# Altium project SM3280_USBA.PrjPcb
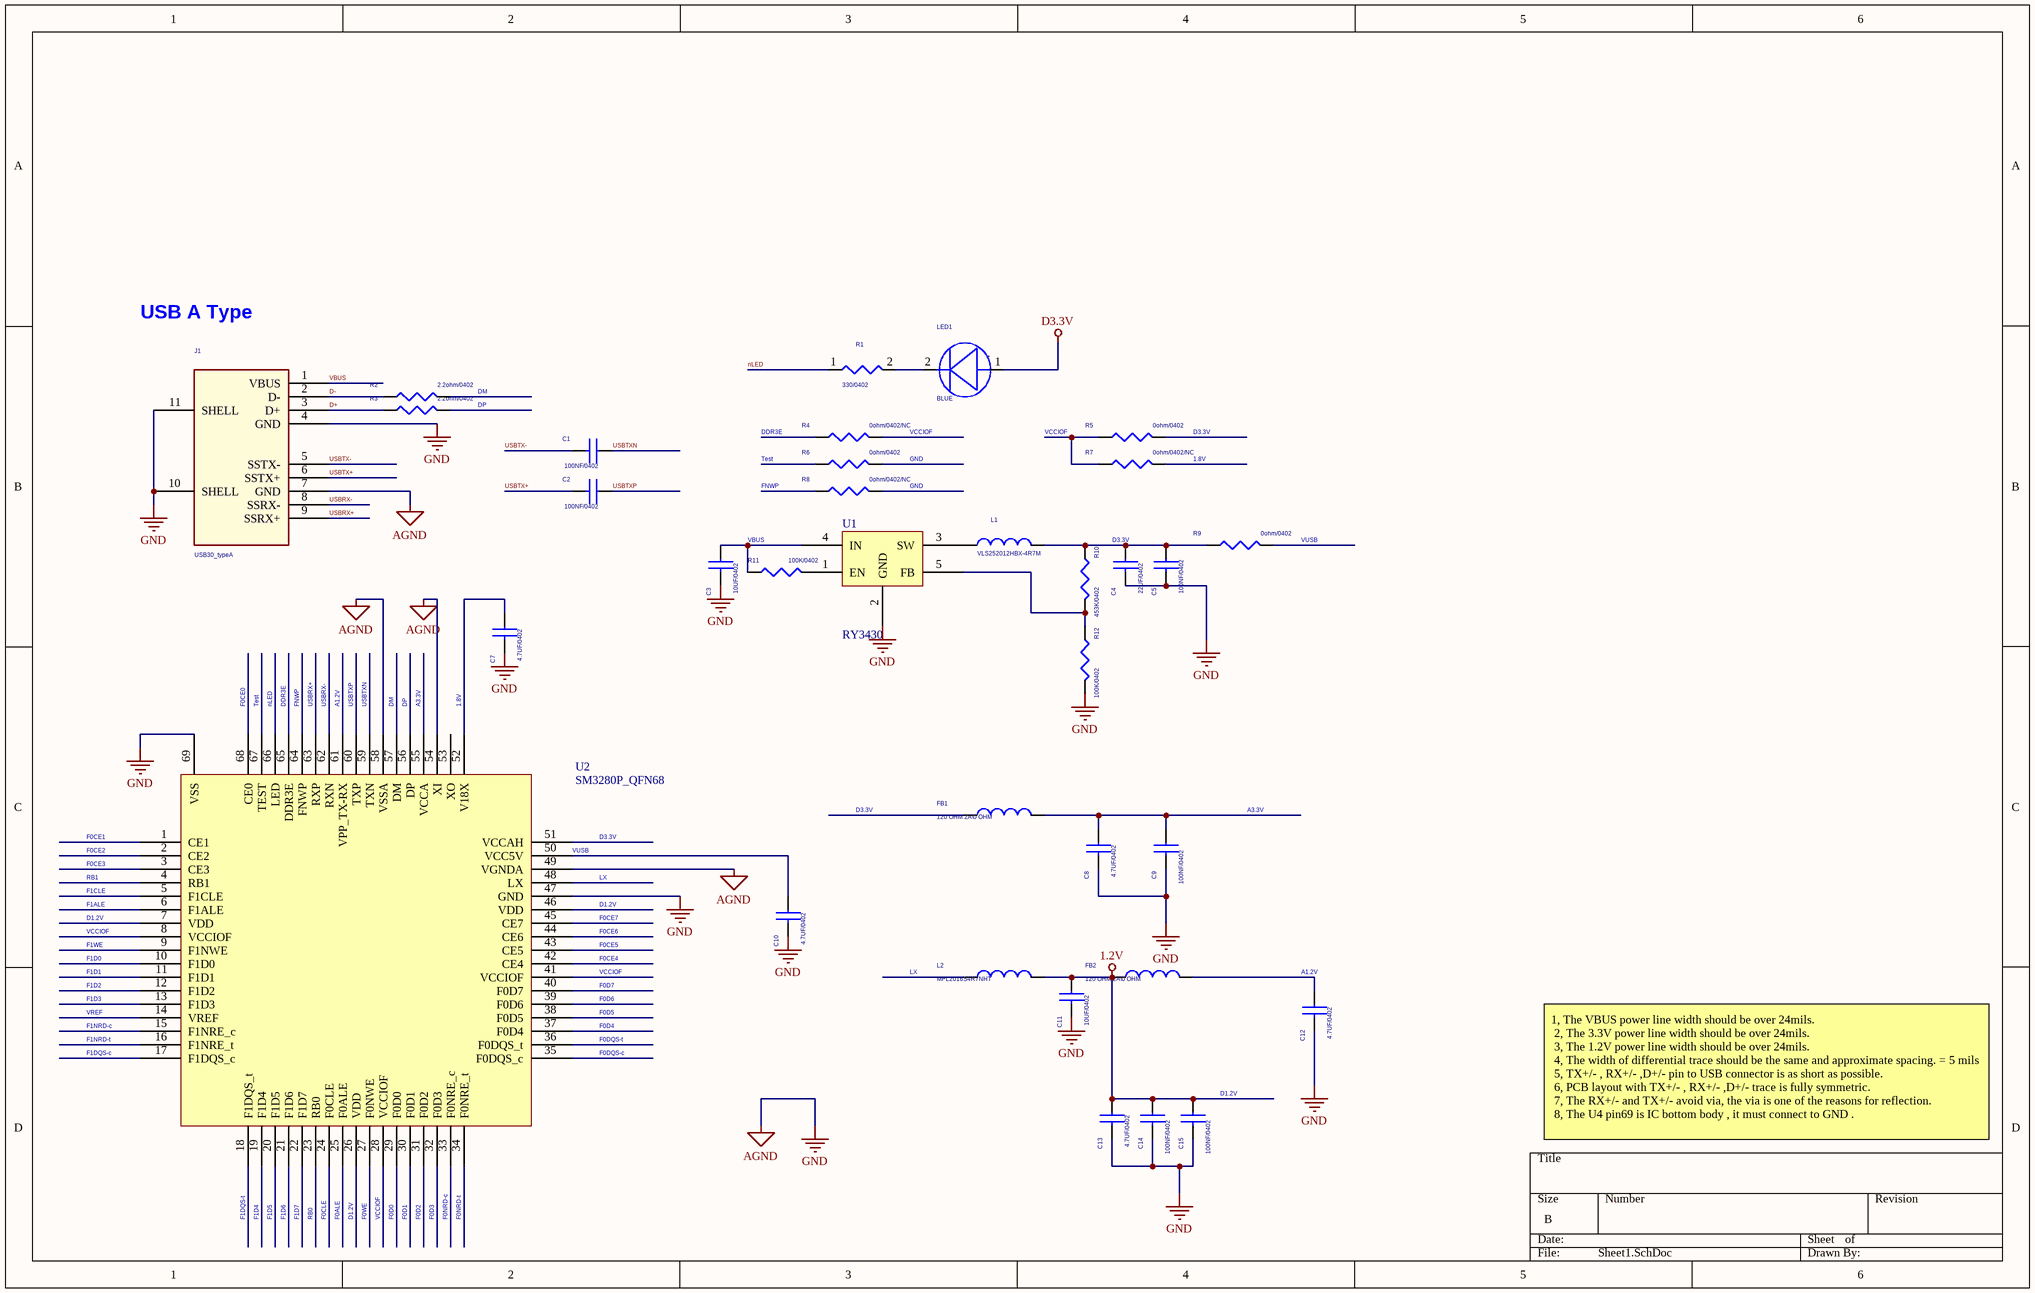
[diagram p0: Sheet1.SchDoc]
2 sheets, 45 parts. Net scope: global (net labels, ports and power ports of the same name join across sheets).
Sheets:
  Sheet1.SchDoc
  Sheet2.SchDoc

## Sheet Sheet1.SchDoc
size B

### Parts
C1  100NF/0402  [C0402]
C2  100NF/0402  [C0402]
C3  10UF/0402  [C0402]
C4  22UF/0402  [C0402]
C5  100NF/0402  [C0402]
C7  4.7UF/0402  [C0402]
C8  4.7UF/0402  [C0402]
C9  100NF/0402  [C0402]
C10  4.7UF/0402  [C0402]
C11  10UF/0402  [C0402]
C12  4.7UF/0402  [C0402]
C13  4.7UF/0402  [C0402]
C14  100NF/0402  [C0201]
C15  100NF/0402  [C0402]
FB1  120 OHM 2A\0 OHM  [SL0402]
FB2  120 OHM 2A\0 OHM  [SL0402]
J1  USB30_typeA  [USB-3.0AAAA]
L1  VLS252012HBX-4R7M  [L2520]
L2  MPL2016S4R7NHT  [L2016]
LED1  BLUE  [LED0603]
R1  330/0402  [R0402]
R2  2.2ohm/0402  [R0402]
R3  2.2ohm/0402  [R0402]
R4  0ohm/0402/NC  [R0201]
R5  0ohm/0402  [R0201]
R6  0ohm/0402  [R0201]
R7  0ohm/0402/NC  [R0201]
R8  0ohm/0402/NC  [R0201]
R9  0ohm/0402  [R0201]
R10  453K/0402  [R0402]
R11  100K/0402  [R0402]
R12  100K/0402  [R0402]
U1  RY3430
U2  SM3280P_QFN68

### Nets
D1.2V: C11.1 C13.1 C14.1 C15.1 FB2.1 L2.2 U2.7(VDD) U2.26(VDD) U2.46(VDD)  [also labelled 1.2V]
D3.3V: C4.1 C5.1 FB1.1 L1.2 LED1.1(ANODE) R5.2 R9.1 R10.1 U2.51(VCCAH)
GND: C3.2 C4.2 C5.2 C7.2 C8.2 C9.2 C10.2 C11.2 C12.2 C13.2 C14.2 C15.2 J1.4(GND) J1.7(GND) J1.10(SHELL) J1.11(SHELL) R6.2 R8.2 R12.2 U1.2(GND) U2.47(GND) U2.49(VGNDA) U2.54(XI) U2.58(VSSA) U2.69(VSS)  [also labelled AGND]
VCCIOF: R4.2 R5.1 R7.1 U2.8(VCCIOF) U2.28(VCCIOF) U2.41(VCCIOF)
VREF: U2.14(VREF)
1.8V: C7.1 R7.2 U2.52(V18X)
A1.2V: C12.1 FB2.2 U2.61(VPP_TX-RX)
A3.3V: C8.1 C9.1 FB1.2 U2.55(VCCA)
D+: J1.3(D+) R3.1
D-: J1.2(D-) R2.1
DDR3E: R4.1 U2.65(DDR3E)
DM: R2.2 U2.57(DM)
DP: R3.2 U2.56(DP)
F0ALE: U2.25(F0ALE)
F0CE0: U2.68(CE0)
F0CE1: U2.1(CE1)
F0CE2: U2.2(CE2)
F0CE3: U2.3(CE3)
F0CE4: U2.42(CE4)
F0CE5: U2.43(CE5)
F0CE6: U2.44(CE6)
F0CE7: U2.45(CE7)
F0CLE: U2.24(F0CLE)
F0D0: U2.29(F0D0)
F0D1: U2.30(F0D1)
F0D2: U2.31(F0D2)
F0D3: U2.32(F0D3)
F0D4: U2.37(F0D4)
F0D5: U2.38(F0D5)
F0D6: U2.39(F0D6)
F0D7: U2.40(F0D7)
F0DQS-c: U2.35(F0DQS_c)
F0DQS-t: U2.36(F0DQS_t)
F0NRD-c: U2.33(F0NRE_c)
F0NRD-t: U2.34(F0NRE_t)
F0WE: U2.27(F0NWE)
F1ALE: U2.6(F1ALE)
F1CLE: U2.5(F1CLE)
F1D0: U2.10(F1D0)
F1D1: U2.11(F1D1)
F1D2: U2.12(F1D2)
F1D3: U2.13(F1D3)
F1D4: U2.19(F1D4)
F1D5: U2.20(F1D5)
F1D6: U2.21(F1D6)
F1D7: U2.22(F1D7)
F1DQS-c: U2.17(F1DQS_c)
F1DQS-t: U2.18(F1DQS_t)
F1NRD-c: U2.15(F1NRE_c)
F1NRD-t: U2.16(F1NRE_t)
F1WE: U2.9(F1NWE)
FNWP: R8.1 U2.64(FNWP)
LX: L2.1 U2.48(LX)
nLED: R1.1 U2.66(LED)
RB0: U2.23(RB0)
RB1: U2.4(RB1)
Test: R6.1 U2.67(TEST)
USBRX+: J1.9(SSRX+) U2.63(RXP)
USBRX-: J1.8(SSRX-) U2.62(RXN)
USBTX+: C2.2 J1.6(SSTX+)
USBTX-: C1.2 J1.5(SSTX-)
USBTXN: C1.1 U2.59(TXN)
USBTXP: C2.1 U2.60(TXP)
VBUS: C3.1 J1.1(VBUS) R11.1 U1.4(IN)
VUSB: C10.1 R9.2 U2.50(VCC5V)
NetL1_1: L1.1 U1.3(SW)
NetLED1_2: LED1.2(CATHODE) R1.2
NetR10_2: R10.2 R12.1 U1.5(FB)

Not connected (* = marked no-connect by the designer): R11 2; U1 1(EN); U2 53(XO)

### Notes on the sheet
- USB A Type
- 1, The VBUS power line width should be over 24mils.
  2, The 3.3V power line width should be over 24mils.
  3, The 1.2V power line width should be over 24mils.
  4, The width of differential trace should be the same and approximate spacing. = 5 mils
  5, TX+/- , RX+/- ,D+/- pin to USB connector is as short as possible.
  6, PCB layout with TX+/- , RX+/- ,D+/- trace is fully symmetric.
  7, The RX+/- and TX+/- avoid via, the via is one of the reasons for reflection.
  8, The U4 pin69 is IC bottom body , it must connect to GND .
- (in symbol LED) +

### Library data of the parts
C1-C5 C7 C8 C10-C13 = C0603: CRITICAL_PART: N; MANUFACTURER: PANASONIC; MANUFACTURER_PN: ECJ1VB0J106M; PART_NUMBER: 11G10210621R; PART_TYPE: 11_C; TABLES: 11; CLASS: Passive; COMPONENT_NAME: MLCC SMD 10UF 6.3V 0603 X5R 20%; ELECTRIC_SPEC: 6.3V 0603 X5R 20%; OPTIONAL: I; TOLERANCE: 20%; CREATED_DATE: 2009/10/6; DATABASE_UPDATE: 2009/10/6; DATASHEET: N/A; PACKAGE_TYPE: SMD; QVL_APPROVE: N
C9 C14 C15 = C0402_Dup1: PART_TYPE: 11_C; PART_NUMBER: 11G101104340; MANUFACTURER_PN: 0402F104Z250CT; MANUFACTURER: WALSIN; TOLERANCE: +80/-20%; QVL_APPROVE: N; OPTIONAL: I; ELECTRIC_SPEC: 25V 0402 Y5V +80/-20%; COMPONENT_NAME: MLCC SMD 100NF 25V 0402 Y5V +80/-20%; CLASS: Passive; TABLES: 11; PACKAGE_TYPE: SMD; DATASHEET: T:\division\SD\JM_CIS_Database\05_Datasheet\11_Capacitor\Walsin_MLCC_All.pdf; DATABASE_UPDATE: 2009/10/6; CRITICAL_PART: N; CREATED_DATE: 2009/10/6
FB1 FB2 = FB0603: FB SMD 120 OHM 2A 0402; Part_Type: 09_Inductor; Part Number: 09G102000160; Manufacturer_PN: BLM18PG121SN1D; Manufacturer: MURATA; QVL_Approve: N; Optional: I; Electric_Spec: 120 OHM 2A 0603; Component_Name: FB SMD 120 OHM 2A 0603; Class: Discrete; Tolerance: N/A; Package Type: SMD; Datasheet: T:\division\SD\JM_CIS_Database\05_Datasheet\09_Inductor\09G102000160.pdf; Critical_Part: N
J1 = USB30 connector_0
L1 = GNR2512PA-1R0M_0: CRITICAL_PART: N; MANUFACTURER: GOTREND; PART_NUMBER: 09G1502034A0; PART_TYPE: 09_Inductor; TABLES: 09; COMPONENT_NAME: CHOKE SMD 1.0UH/3.45A(MAX) +/-20% GNR2512PA-1R0M; ELECTRIC_SPEC: 1.0UH/3.45A(MAX); OPTIONAL: I; TOLERANCE: +/-20%; CREATED_DATE: 2015/11/6; DATABASE_UPDATE: 2015/11/6; DATASHEET: T:\division\Division_Share\JM_CIS_Database\05_Datasheet\09_Inductor\09G1502034A0.pdf; MANUFACTURER_PN: GNR2512PA-1R0M; PACKAGE_TYPE: SMD; QVL_APPROVE: N
L2 = FB0603: Part_Type: 09_Inductor; Part Number: 09G102000160; Manufacturer_PN: BLM18PG121SN1D; Manufacturer: MURATA; QVL_Approve: N; Optional: I; Electric_Spec: 120 OHM 2A 0603; Component_Name: FB SMD 120 OHM 2A 0603; Class: Discrete; Tolerance: N/A; Package Type: SMD; Datasheet: T:\division\SD\JM_CIS_Database\05_Datasheet\09_Inductor\09G102000160.pdf; Critical_Part: N
LED1 = LED: Part Number: 07G015200206; Manufacture: LITEON; Critical_Part: N; Component_Name: LED BLUE (0603) SMD; Electric_SPE: If=5mA/3V; Sourcer: 綠▅篴(X15454); Data_Sheet: K:\DataSheet\07-DISCRETE\07G015200206.pdf; Device: led_2p_63x31_h16; Class: DISCRETE; metal_fabrication: 00000011; Package_Type: SMD; Part Type: 07DISCRETE\LED; Database_Update: 2007/3/3; Modify_Data: 2005/8/10; Optional: N/A; Subsystem_ID: N/A; Colay_Group: N/A; Colay_Alternate: N/A
R1 = R_Dup1: Critical_Part: N; Manufacture: TA-I; Part Number: 10G212102004010; metal_fabrication: 0000001U; Class: DISCRETE; Data_Sheet: J:\DataSheet\10-RESISTOR\10G212102004010.zip; Tolerance: 5%; Electric_SPE: 1/16W; Component_Name: RES 1K OHM 1/16W(0402) 5%; Colay_Alternate: N/A; Colay_Group: N/A; Subsystem_ID: N/A; Optional: N/A; Modify_Data: 2005/2/25; Database_Update: 2009/9/12; Part Type: 10RESISTOR\RESISTOR; Device: r0402; Package_Type: SMD; Symbol_Preview: http://tp-caevm-01/ET_Test/FpPre.aspx?PN=10G212102004010&LIB=COM; Status: All某纔舦5
R2-R9 = R
R10-R12 = R0402: CRITICAL_PART: N; MANUFACTURER: WALSIN; MANUFACTURER_PN: WR04X104JTL; PART_NUMBER: 10G101010410; PART_TYPE: 10_R; TABLES: 10; CLASS: Passive; COMPONENT_NAME: RES SMD 100K OHM 1/16W 0402 5%; ELECTRIC_SPEC: 1/16W 0402 5%; OPTIONAL: I; TOLERANCE: 5%; CREATED_DATE: 2009/10/6; DATABASE_UPDATE: 2009/10/6; DATASHEET: T:\division\SD\JM_CIS_Database\05_Datasheet\10_Resistor\WALSIN_R_All_2009.pdf; PACKAGE_TYPE: SMD; QVL_APPROVE: N

## Sheet Sheet2.SchDoc
size C
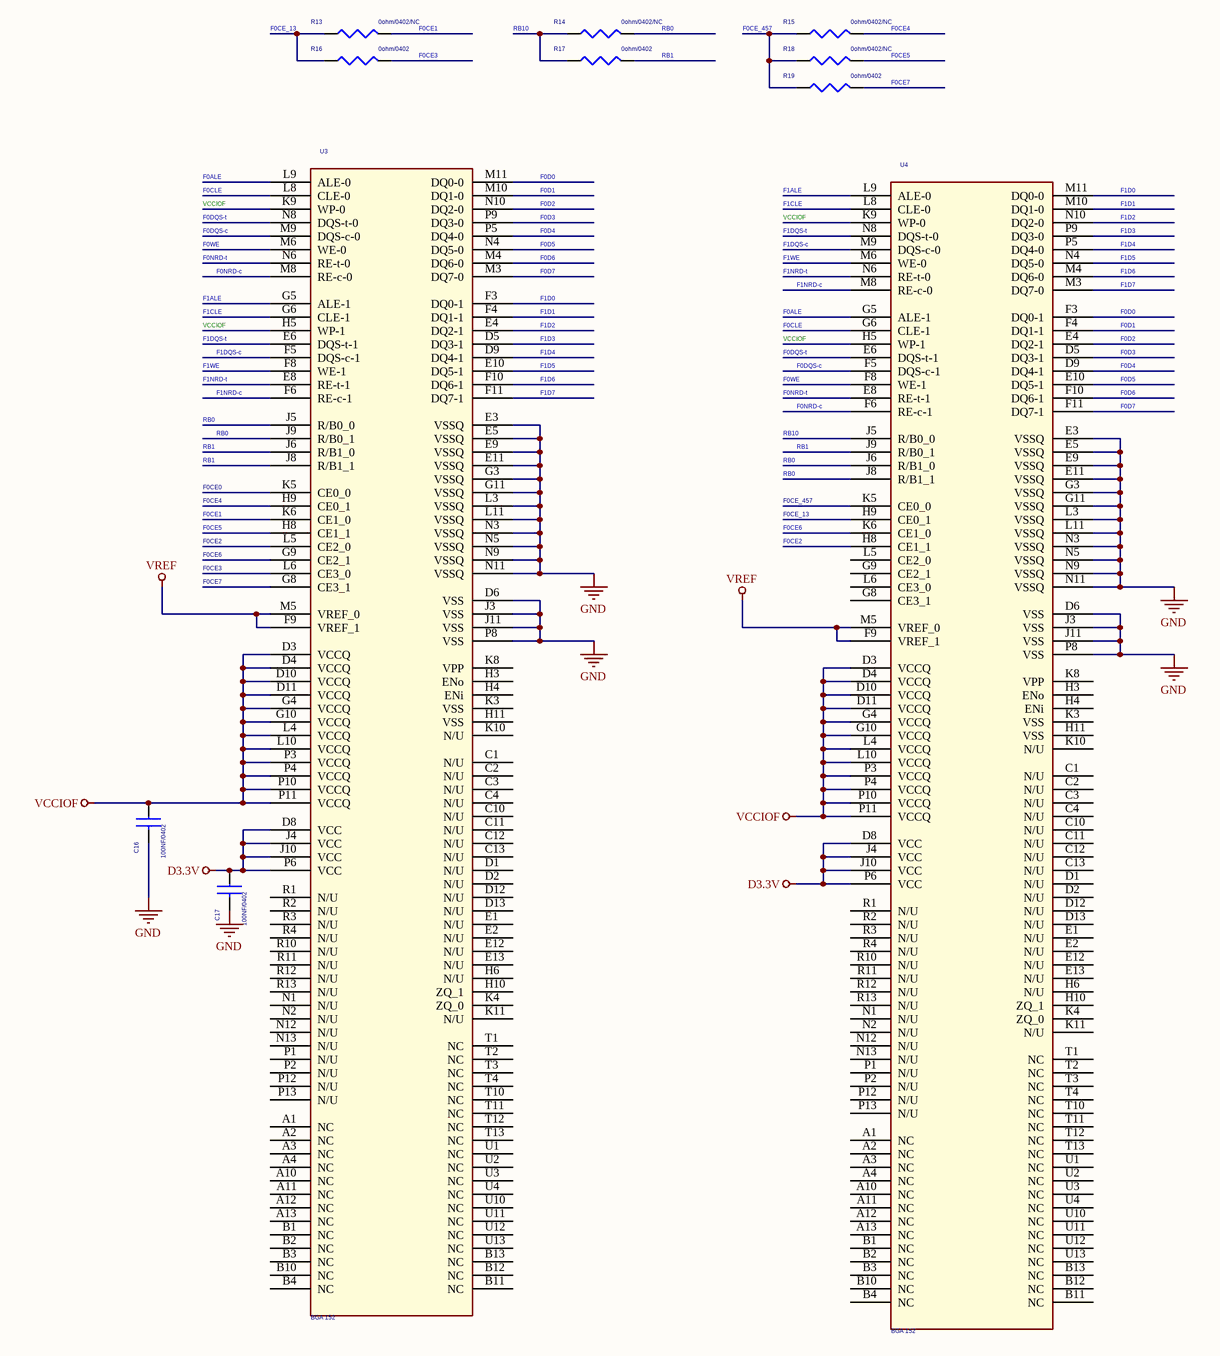
[diagram p1: Sheet2.SchDoc]

### Parts
C16  100NF/0402  [C0402]
C17  100NF/0402  [C0402]
R13  0ohm/0402/NC  [R0201]
R14  0ohm/0402/NC  [R0201]
R15  0ohm/0402/NC  [R0201]
R16  0ohm/0402  [R0201]
R17  0ohm/0402  [R0201]
R18  0ohm/0402/NC  [R0201]
R19  0ohm/0402  [R0201]
U3  BGA 152  [bga152_1_0_14x18]
U4  BGA 152  [bga152_1_0_14x18]

### Nets
D3.3V: C17.1 U3.D8(VCC) U3.J4(VCC) U3.J10(VCC) U3.P6(VCC) U4.D8(VCC) U4.J4(VCC) U4.J10(VCC) U4.P6(VCC)
GND: C16.2 C17.2 U3.D6(VSS) U3.E3(VSSQ) U3.E5(VSSQ) U3.E9(VSSQ) U3.E11(VSSQ) U3.G3(VSSQ) U3.G11(VSSQ) U3.J3(VSS) U3.J11(VSS) U3.L3(VSSQ) U3.L11(VSSQ) U3.N3(VSSQ) U3.N5(VSSQ) U3.N9(VSSQ) U3.N11(VSSQ) U3.P8(VSS) U4.D6(VSS) U4.E3(VSSQ) U4.E5(VSSQ) U4.E9(VSSQ) U4.E11(VSSQ) U4.G3(VSSQ) U4.G11(VSSQ) U4.J3(VSS) U4.J11(VSS) U4.L3(VSSQ) U4.L11(VSSQ) U4.N3(VSSQ) U4.N5(VSSQ) U4.N9(VSSQ) U4.N11(VSSQ) U4.P8(VSS)
VCCIOF: C16.1 U3.D3(VCCQ) U3.D4(VCCQ) U3.D10(VCCQ) U3.D11(VCCQ) U3.G4(VCCQ) U3.G10(VCCQ) U3.H5(WP-1) U3.K9(WP-0) U3.L4(VCCQ) U3.L10(VCCQ) U3.P3(VCCQ) U3.P4(VCCQ) U3.P10(VCCQ) U3.P11(VCCQ) U4.D3(VCCQ) U4.D4(VCCQ) U4.D10(VCCQ) U4.D11(VCCQ) U4.G4(VCCQ) U4.G10(VCCQ) U4.H5(WP-1) U4.K9(WP-0) U4.L4(VCCQ) U4.L10(VCCQ) U4.P3(VCCQ) U4.P4(VCCQ) U4.P10(VCCQ) U4.P11(VCCQ)
VREF: U3.F9(VREF_1) U3.M5(VREF_0) U4.F9(VREF_1) U4.M5(VREF_0)
F0ALE: U3.L9(ALE-0) U4.G5(ALE-1)
F0CE0: U3.K5(CE0_0)
F0CE1: R13.2 U3.K6(CE1_0)
F0CE2: U3.L5(CE2_0) U4.H8(CE1_1)
F0CE3: R16.2 U3.L6(CE3_0)
F0CE4: R15.2 U3.H9(CE0_1)
F0CE5: R18.2 U3.H8(CE1_1)
F0CE6: U3.G9(CE2_1) U4.K6(CE1_0)
F0CE7: R19.2 U3.G8(CE3_1)
F0CE_13: R13.1 R16.1 U4.H9(CE0_1)
F0CE_457: R15.1 R18.1 R19.1 U4.K5(CE0_0)
F0CLE: U3.L8(CLE-0) U4.G6(CLE-1)
F0D0: U3.M11(DQ0-0) U4.F3(DQ0-1)
F0D1: U3.M10(DQ1-0) U4.F4(DQ1-1)
F0D2: U3.N10(DQ2-0) U4.E4(DQ2-1)
F0D3: U3.P9(DQ3-0) U4.D5(DQ3-1)
F0D4: U3.P5(DQ4-0) U4.D9(DQ4-1)
F0D5: U3.N4(DQ5-0) U4.E10(DQ5-1)
F0D6: U3.M4(DQ6-0) U4.F10(DQ6-1)
F0D7: U3.M3(DQ7-0) U4.F11(DQ7-1)
F0DQS-c: U3.M9(DQS-c-0) U4.F5(DQS-c-1)
F0DQS-t: U3.N8(DQS-t-0) U4.E6(DQS-t-1)
F0NRD-c: U3.M8(RE-c-0) U4.F6(RE-c-1)
F0NRD-t: U3.N6(RE-t-0) U4.E8(RE-t-1)
F0WE: U3.M6(WE-0) U4.F8(WE-1)
F1ALE: U3.G5(ALE-1) U4.L9(ALE-0)
F1CLE: U3.G6(CLE-1) U4.L8(CLE-0)
F1D0: U3.F3(DQ0-1) U4.M11(DQ0-0)
F1D1: U3.F4(DQ1-1) U4.M10(DQ1-0)
F1D2: U3.E4(DQ2-1) U4.N10(DQ2-0)
F1D3: U3.D5(DQ3-1) U4.P9(DQ3-0)
F1D4: U3.D9(DQ4-1) U4.P5(DQ4-0)
F1D5: U3.E10(DQ5-1) U4.N4(DQ5-0)
F1D6: U3.F10(DQ6-1) U4.M4(DQ6-0)
F1D7: U3.F11(DQ7-1) U4.M3(DQ7-0)
F1DQS-c: U3.F5(DQS-c-1) U4.M9(DQS-c-0)
F1DQS-t: U3.E6(DQS-t-1) U4.N8(DQS-t-0)
F1NRD-c: U3.F6(RE-c-1) U4.M8(RE-c-0)
F1NRD-t: U3.E8(RE-t-1) U4.N6(RE-t-0)
F1WE: U3.F8(WE-1) U4.M6(WE-0)
RB0: R14.2 U3.J5(R/B0_0) U3.J9(R/B0_1) U4.J6(R/B1_0) U4.J8(R/B1_1)
RB1: R17.2 U3.J6(R/B1_0) U3.J8(R/B1_1) U4.J9(R/B0_1)
RB10: R14.1 R17.1 U4.J5(R/B0_0)

Not connected (* = marked no-connect by the designer): U3 A1(NC) A2(NC) A3(NC) A4(NC) A10(NC) A11(NC) A12(NC) A13(NC) B1(NC) B2(NC) B3(NC) B4(NC) B10(NC) B11(NC) B12(NC) B13(NC) C1(N/U) C2(N/U) C3(N/U) C4(N/U) C10(N/U) C11(N/U) C12(N/U) C13(N/U) D1(N/U) D2(N/U) D12(N/U) D13(N/U) E1(N/U) E2(N/U) E12(N/U) E13(N/U) H3(ENo) H4(ENi) H6(N/U) H10(ZQ_1) H11(VSS) K3(VSS) K4(ZQ_0) K8(VPP) K10(N/U) K11(N/U) N1(N/U) N2(N/U) N12(N/U) N13(N/U) P1(N/U) P2(N/U) P12(N/U) P13(N/U) R1(N/U) R2(N/U) R3(N/U) R4(N/U) R10(N/U) R11(N/U) R12(N/U) R13(N/U) T1(NC) T2(NC) T3(NC) T4(NC) T10(NC) T11(NC) T12(NC) T13(NC) U1(NC) U2(NC) U3(NC) U4(NC) U10(NC) U11(NC) U12(NC) U13(NC); U4 A1(NC) A2(NC) A3(NC) A4(NC) A10(NC) A11(NC) A12(NC) A13(NC) B1(NC) B2(NC) B3(NC) B4(NC) B10(NC) B11(NC) B12(NC) B13(NC) C1(N/U) C2(N/U) C3(N/U) C4(N/U) C10(N/U) C11(N/U) C12(N/U) C13(N/U) D1(N/U) D2(N/U) D12(N/U) D13(N/U) E1(N/U) E2(N/U) E12(N/U) E13(N/U) G8(CE3_1) G9(CE2_1) H3(ENo) H4(ENi) H6(N/U) H10(ZQ_1) H11(VSS) K3(VSS) K4(ZQ_0) K8(VPP) K10(N/U) K11(N/U) L5(CE2_0) L6(CE3_0) N1(N/U) N2(N/U) N12(N/U) N13(N/U) P1(N/U) P2(N/U) P12(N/U) P13(N/U) R1(N/U) R2(N/U) R3(N/U) R4(N/U) R10(N/U) R11(N/U) R12(N/U) R13(N/U) T1(NC) T2(NC) T3(NC) T4(NC) T10(NC) T11(NC) T12(NC) T13(NC) U1(NC) U2(NC) U3(NC) U4(NC) U10(NC) U11(NC) U12(NC) U13(NC)

### Library data of the parts
C16 C17 = C0402_Dup1: as C9 on sheet Sheet1; PACKAGE_TYPE: SMD; DATASHEET: T:\division\SD\JM_CIS_Database\05_Datasheet\11_Capacitor\Walsin_MLCC_All.pdf; DATABASE_UPDATE: 2009/10/6; CRITICAL_PART: N; CREATED_DATE: 2009/10/6
R13-R19 = R
U3 U4 = TMP_0

## Nets that join several sheets
D3.3V: Sheet1 (9 pins), Sheet2 (9 pins)
GND: Sheet1 (25 pins), Sheet2 (34 pins)
VCCIOF: Sheet1 (6 pins), Sheet2 (29 pins)
VREF: Sheet1 (U2.14), Sheet2 (U3.F9 U3.M5 U4.F9 U4.M5)
F0ALE: Sheet1 (U2.25), Sheet2 (U3.L9 U4.G5)
F0CE0: Sheet1 (U2.68), Sheet2 (U3.K5)
F0CE1: Sheet1 (U2.1), Sheet2 (R13.2 U3.K6)
F0CE2: Sheet1 (U2.2), Sheet2 (U3.L5 U4.H8)
F0CE3: Sheet1 (U2.3), Sheet2 (R16.2 U3.L6)
F0CE4: Sheet1 (U2.42), Sheet2 (R15.2 U3.H9)
F0CE5: Sheet1 (U2.43), Sheet2 (R18.2 U3.H8)
F0CE6: Sheet1 (U2.44), Sheet2 (U3.G9 U4.K6)
F0CE7: Sheet1 (U2.45), Sheet2 (R19.2 U3.G8)
F0CLE: Sheet1 (U2.24), Sheet2 (U3.L8 U4.G6)
F0D0: Sheet1 (U2.29), Sheet2 (U3.M11 U4.F3)
F0D1: Sheet1 (U2.30), Sheet2 (U3.M10 U4.F4)
F0D2: Sheet1 (U2.31), Sheet2 (U3.N10 U4.E4)
F0D3: Sheet1 (U2.32), Sheet2 (U3.P9 U4.D5)
F0D4: Sheet1 (U2.37), Sheet2 (U3.P5 U4.D9)
F0D5: Sheet1 (U2.38), Sheet2 (U3.N4 U4.E10)
F0D6: Sheet1 (U2.39), Sheet2 (U3.M4 U4.F10)
F0D7: Sheet1 (U2.40), Sheet2 (U3.M3 U4.F11)
F0DQS-c: Sheet1 (U2.35), Sheet2 (U3.M9 U4.F5)
F0DQS-t: Sheet1 (U2.36), Sheet2 (U3.N8 U4.E6)
F0NRD-c: Sheet1 (U2.33), Sheet2 (U3.M8 U4.F6)
F0NRD-t: Sheet1 (U2.34), Sheet2 (U3.N6 U4.E8)
F0WE: Sheet1 (U2.27), Sheet2 (U3.M6 U4.F8)
F1ALE: Sheet1 (U2.6), Sheet2 (U3.G5 U4.L9)
F1CLE: Sheet1 (U2.5), Sheet2 (U3.G6 U4.L8)
F1D0: Sheet1 (U2.10), Sheet2 (U3.F3 U4.M11)
F1D1: Sheet1 (U2.11), Sheet2 (U3.F4 U4.M10)
F1D2: Sheet1 (U2.12), Sheet2 (U3.E4 U4.N10)
F1D3: Sheet1 (U2.13), Sheet2 (U3.D5 U4.P9)
F1D4: Sheet1 (U2.19), Sheet2 (U3.D9 U4.P5)
F1D5: Sheet1 (U2.20), Sheet2 (U3.E10 U4.N4)
F1D6: Sheet1 (U2.21), Sheet2 (U3.F10 U4.M4)
F1D7: Sheet1 (U2.22), Sheet2 (U3.F11 U4.M3)
F1DQS-c: Sheet1 (U2.17), Sheet2 (U3.F5 U4.M9)
F1DQS-t: Sheet1 (U2.18), Sheet2 (U3.E6 U4.N8)
F1NRD-c: Sheet1 (U2.15), Sheet2 (U3.F6 U4.M8)
F1NRD-t: Sheet1 (U2.16), Sheet2 (U3.E8 U4.N6)
F1WE: Sheet1 (U2.9), Sheet2 (U3.F8 U4.M6)
RB0: Sheet1 (U2.23), Sheet2 (5 pins)
RB1: Sheet1 (U2.4), Sheet2 (R17.2 U3.J6 U3.J8 U4.J9)